# EAGLE design pro_mini_2_clamps (EAGLE 7.1.0)
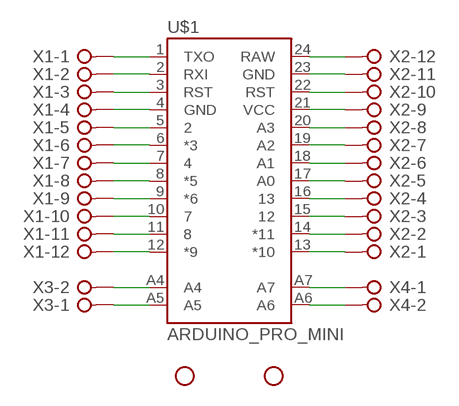
[diagram p0: schematic, sheet 1]

## Parts
STANDOFF1  STAND-OFF  [STAND-OFF]
STANDOFF2  STAND-OFF  [STAND-OFF]
U$1  ARDUINO_PRO_MINI  [ARDUINO_PRO_MINI]
X1  W237-12P  [W237-12P]
X2  W237-12P  [W237-12P]
X3  W237-02P  [W237-132]
X4  W237-02P  [W237-132]

## Nets
N$1: U$1.1(TXO) X1.1
N$2: U$1.2(RXI) X1.2
N$3: U$1.3(RST) X1.3
N$4: U$1.4(GND) X1.4
N$5: U$1.5 X1.5
N$6: U$1.6(*3) X1.6
N$7: U$1.7 X1.7
N$8: U$1.8(*5) X1.8
N$9: U$1.9(*6) X1.9
N$10: U$1.10 X1.10
N$11: U$1.11 X1.11
N$12: U$1.12(*9) X1.12
N$13: U$1.24(RAW) X2.12
N$14: U$1.23(GND) X2.11
N$15: U$1.22(RST) X2.10
N$16: U$1.21(VCC) X2.9
N$17: U$1.20(A3) X2.8
N$18: U$1.19(A2) X2.7
N$19: U$1.18(A1) X2.6
N$20: U$1.17(A0) X2.5
N$21: U$1.16 X2.4
N$22: U$1.15 X2.3
N$23: U$1.14(*11) X2.2
N$24: U$1.13(*10) X2.1
N$25: U$1.A7 X4.1
N$26: U$1.A6 X4.2
N$27: U$1.A4 X3.2
N$28: U$1.A5 X3.1

## Library data of the parts
STANDOFF1 STANDOFF2 = SparkFun-Electromechanical:STAND-OFF: #4 Stand Off This is the mechanical footprint for a #4 phillips button head screw. Use the keepout ring to avoid running the screw head into surrounding components. SKU : PRT-00447
U$1 = SparkFun-Boards:ARDUINO_PRO_MINI
X1 X2 = con-wago-508:W237-12P: WAGO SREW CLAMP; OC_FARNELL: unknown; OC_NEWARK: unknown
X3 X4 = con-wago-508:W237-02P: WAGO SREW CLAMP; OC_FARNELL: unknown; OC_NEWARK: unknown

## Board
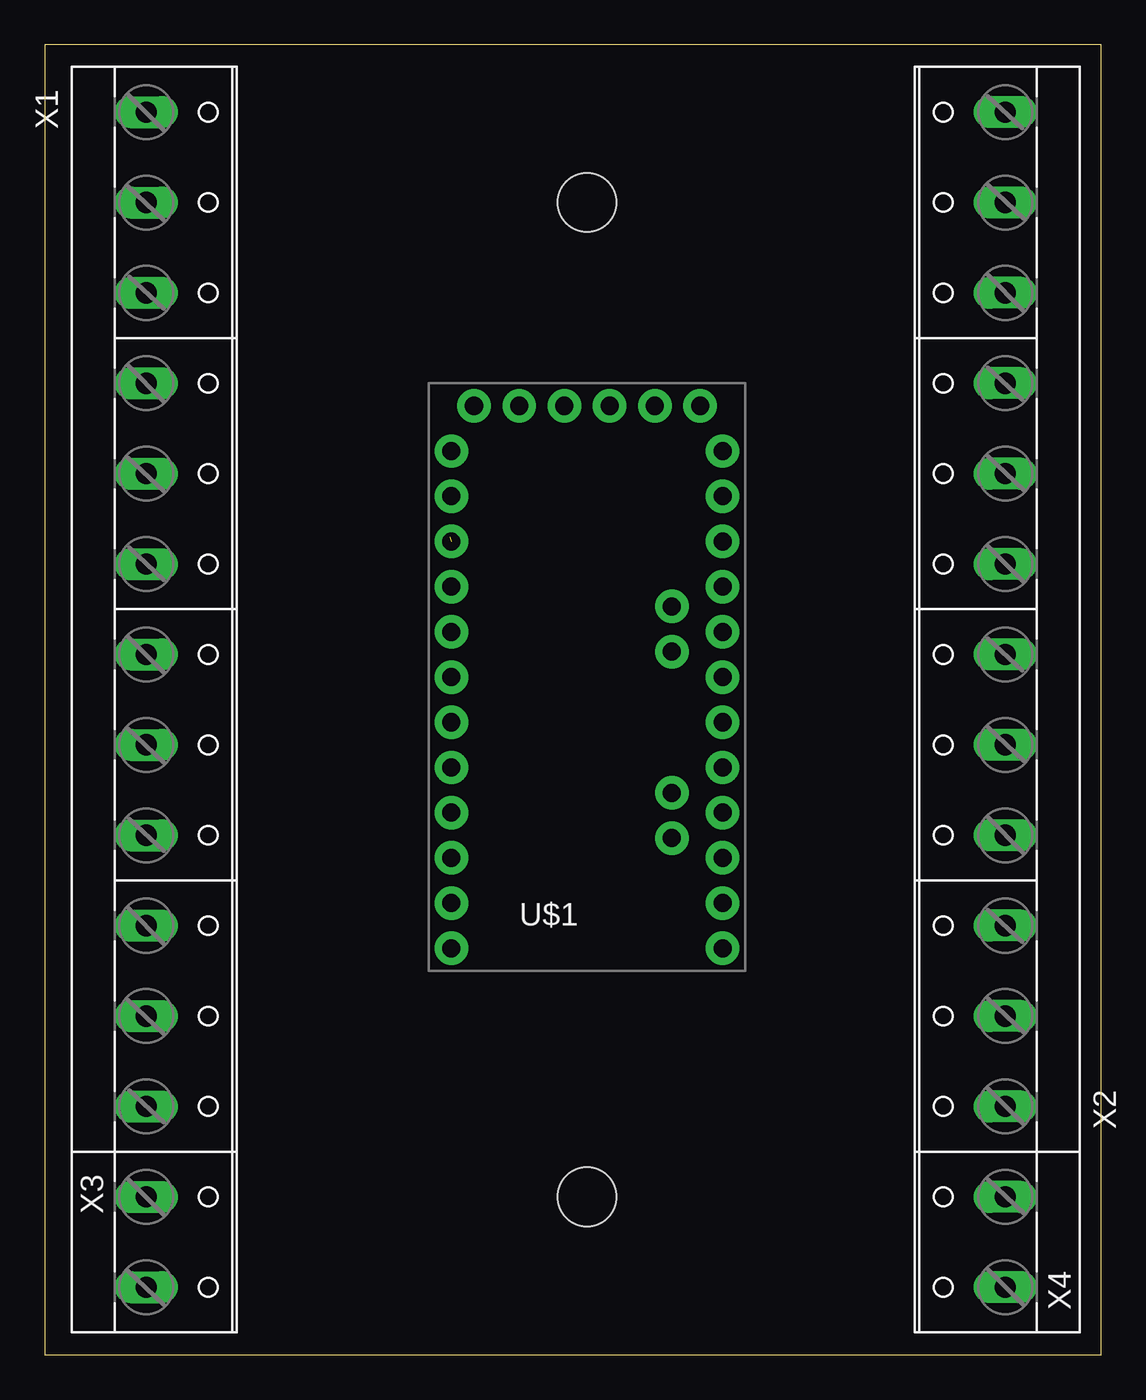
[diagram p1: board, top side]
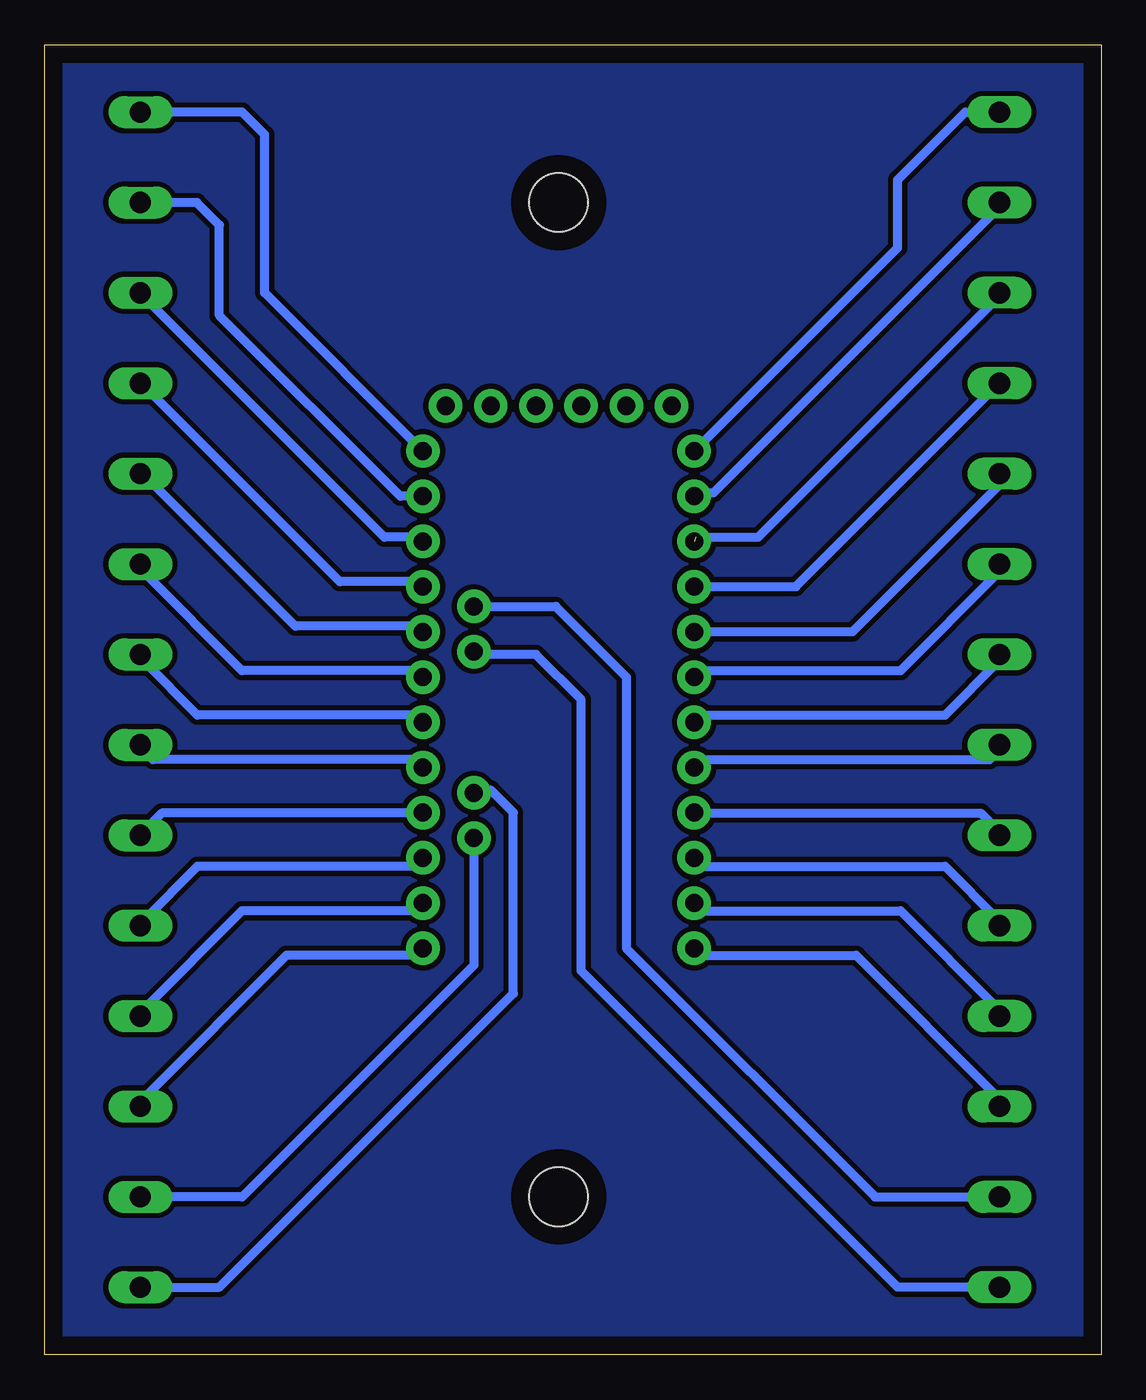
[diagram p2: board, bottom side, seen from below]

Size 59.36 x 73.65 mm. Coordinates in mm from the lower left corner, seen from the top.
Outline: 0,0 59.36,0 59.36,73.65 0,73.65 0,0
Copper layers (1*16): Top 0.035mm / dielectric 1.5mm / Bottom 0.035mm
Design rules "default *": minimum track width 20mil, minimum drill 24mil, track to track 8mil, track to pad 8mil, pad to pad 8mil, via to via 8mil, smd to smd 8mil, copper to edge 40mil, drill to drill 8mil, minimum pad ring 10mil, minimum via ring 8mil, stop-mask expansion 4mil, vias tented up to drill 0mil, thermal gap 10mil

### Footprints (pad centres in the part's own frame; a part is rotated, then mirrored left to right if it is on the bottom)
STAND-OFF = hole 3.302: 0,0
ARDUINO_PRO_MINI = drill 1.016 pad 1.88: 1 -7.62,12.7; 2 -7.62,10.16; 3 -7.62,7.62; 4 -7.62,5.08; 5 -7.62,2.54; 6 -7.62,0; 7 -7.62,-2.54; 8 -7.62,-5.08; 9 -7.62,-7.62; 10 -7.62,-10.16; 11 -7.62,-12.7; 12 -7.62,-15.24; 13 7.62,-15.24; 14 7.62,-12.7; 15 7.62,-10.16; 16 7.62,-7.62; 17 7.62,-5.08; 18 7.62,-2.54; 19 7.62,0; 20 7.62,2.54; 21 7.62,5.08; 22 7.62,7.62; 23 7.62,10.16; 24 7.62,12.7; A4 4.763,1.429; A5 4.763,3.969; A6 4.763,-9.049; A7 4.763,-6.509; BLK -6.35,15.24; GND -3.81,15.24; GRN 6.35,15.24; RXI 1.27,15.24; TXO 3.81,15.24; VCC -1.27,15.24
W237-12P = drill 1.194 long: 1 -27.94,-0.635; 2 -22.86,-0.635; 3 -17.78,-0.635; 4 -12.7,-0.635; 5 -7.62,-0.635; 6 -2.54,-0.635; 7 2.54,-0.635; 8 7.62,-0.635; 9 12.7,-0.635; 10 17.78,-0.635; 11 22.86,-0.635; 12 27.94,-0.635
W237-132 = drill 1.194 long: 1 -2.54,-0.635; 2 2.54,-0.635

### Placement (x,y rotation side)
STANDOFF1  30.48,64.77 0 top
STANDOFF2  30.48,8.89 0 top
U$1  30.48,38.1 0 top
X1  6.35,41.91 270 top
X2  53.34,41.91 90 top
X3  6.35,6.35 270 top
X4  53.34,6.35 90 top

### Tracks (layer width: path | path; a pad name or v marks a point on that pad's centre or on a via)
N$1
  Bottom 0.508: U$1.1 11.43,62.23 11.43,66.04 7.62,69.85 X1.1
N$2
  Bottom 0.508: X1.2 5.77,64.46 21.77,48.46 22.77,48.46 U$1.2
N$3  (1 unrouted)
  Bottom 0.508: X1.3 5.77,59.46 19.27,45.96 22.77,45.96
N$4
  Bottom 0.508: U$1.4 17.14,43.18 X1.4
N$5
  Bottom 0.508: X1.5 5.71,48.9 13.97,40.64 U$1.5
N$6
  Bottom 0.508: X1.6 5.77,43.96 11.27,38.46 22.77,38.46 U$1.6
N$7
  Bottom 0.508: X1.7 5.77,38.96 8.77,35.96 22.77,35.96 U$1.7
N$8
  Bottom 0.508: X1.8 5.77,33.96 6.27,33.46 22.77,33.46 U$1.8
N$9
  Bottom 0.508: X1.9 5.77,29.46 6.77,30.46 22.77,30.46 U$1.9
N$10
  Bottom 0.508: X1.10 5.77,24.46 8.77,27.46 22.77,27.46 U$1.10
N$11
  Bottom 0.508: X1.11 5.77,19.46 11.27,24.96 22.77,24.96 U$1.11
N$12
  Bottom 0.508: X1.12 5.77,14.46 13.77,22.46 22.77,22.46 U$1.12
N$13
  Bottom 0.508: U$1.24 46.99,59.69 46.99,68.58 48.26,69.85 X2.12
N$14
  Bottom 0.508: U$1.23 39.37,48.26 49.53,58.42 49.53,63.5 50.8,64.77 X2.11
N$15
  Bottom 0.508: X2.10 53.77,59.46 40.27,45.96 38.27,45.96 U$1.22
N$16
  Bottom 0.508: X2.9 53.77,54.46 42.77,43.46 38.27,43.46 U$1.21
N$17
  Bottom 0.508: X2.8 53.77,49.46 45.27,40.96 38.27,40.96 U$1.20
N$18
  Bottom 0.508: X2.7 53.77,43.96 48.27,38.46 38.27,38.46 U$1.19
N$19
  Bottom 0.508: X2.6 53.77,38.96 50.77,35.96 38.27,35.96 U$1.18
N$20
  Bottom 0.508: X2.5 53.77,33.96 53.27,33.46 38.27,33.46 U$1.17
N$21
  Bottom 0.508: X2.4 53.77,29.46 52.77,30.46 38.27,30.46 U$1.16
N$22
  Bottom 0.508: X2.3 53.77,24.46 50.77,27.46 38.27,27.46 U$1.15
N$23
  Bottom 0.508: X2.2 53.77,19.46 48.27,24.96 38.27,24.96 U$1.14
N$24
  Bottom 0.508: X2.1 53.77,14.46 45.77,22.46 38.27,22.46 U$1.13
N$25
  Bottom 0.508: X4.1 49.53,3.81 33.02,20.32 33.02,30.48 34.29,31.75 35.08,31.75 U$1.A7
N$26
  Bottom 0.508: U$1.A6 35.24,21.91 48.26,8.89 X4.2
N$27
  Bottom 0.508: X3.2 11.43,3.81 29.21,21.59 29.21,36.83 31.75,39.37 35.08,39.37 U$1.A4
N$28
  Bottom 0.508: U$1.A5 30.64,42.07 26.67,38.1 26.67,22.86 12.7,8.89 X3.1
N$29
  pour Bottom (isolate 0.3): 0,73.66 59.69,73.66 59.69,0 0,0